# EAGLE design uass-antena-side (EAGLE 9.6.2)
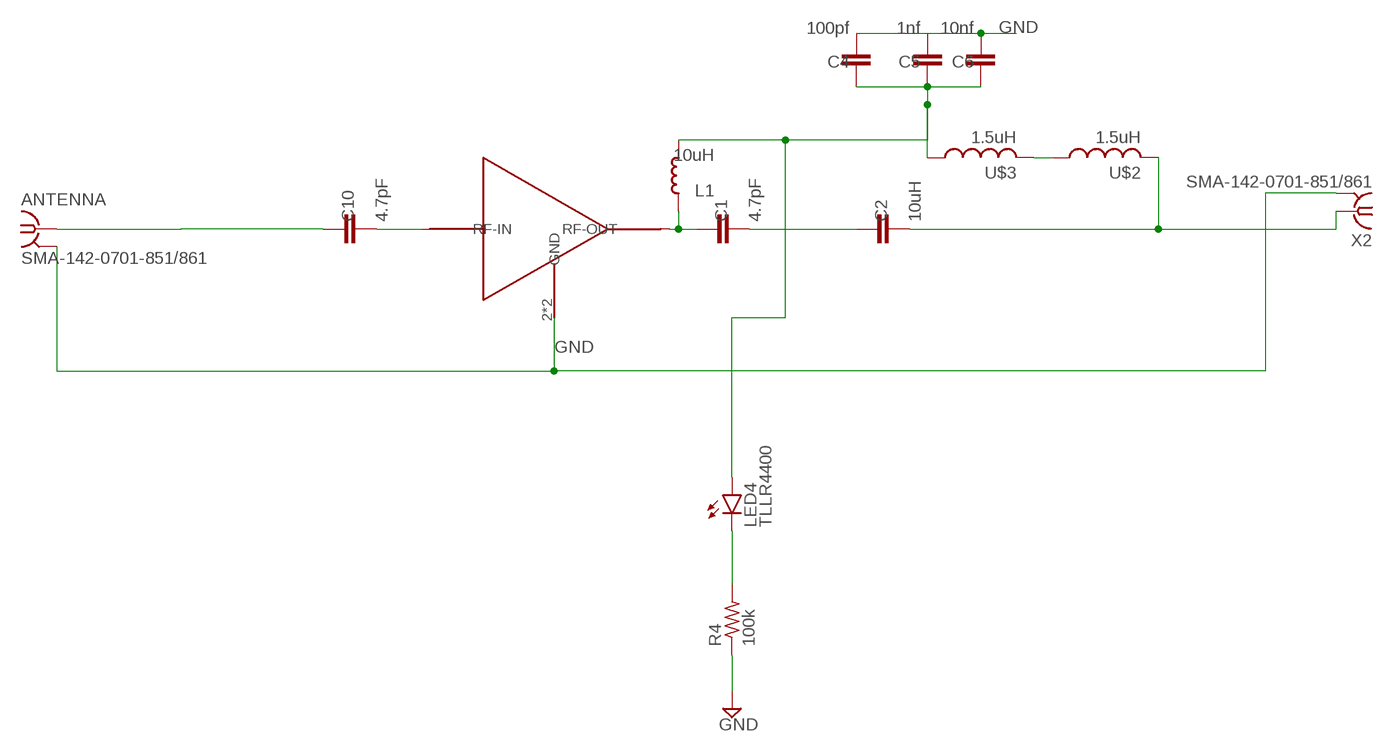
[diagram p0: schematic, sheet 1]

## Parts
ANTENNA  SMA-142-0701-851/861  [J502-ND-142-0701-851/861]
C1  4.7pF  10UF-0603-6.3V-20%  [0603]
C2  10uH  10UF-0603-6.3V-20%  [0603]
C4  100pf  10UF-0603-6.3V-20%  [0603]
C5  1nf  10UF-0603-6.3V-20%  [0603]
C6  10nf  10UF-0603-6.3V-20%  [0603]
C10  4.7pF  10UF-0603-6.3V-20%  [0603]
L1  10uH  L_0603  [L0603]
LED4  TLLR4400  [LED3MM]
R4  100k  R-US_R0603  [R0603]
U$1  PSA4-5043+  [PSA4-5043+]
U$2  1.5uH  L504  [C0504]
U$3  1.5uH  L504  [C0504]
X2  SMA-142-0701-851/861  [J502-ND-142-0701-851/861]

## Nets
5V: C4.1 C5.1 C6.1 L1.1 LED4.A U$3.1
GND: ANTENNA.G@1 ANTENNA.G@2 ANTENNA.G@3 ANTENNA.G@4 C4.2 C5.2 C6.2 R4.1 U$1.2(GND) U$1.4(GND) X2.G@1 X2.G@2 X2.G@3 X2.G@4
N$1: C2.2 U$2.2 X2.1
N$2: U$2.1 U$3.2
N$26: C1.2 C2.1
N$30: LED4.K(C) R4.2
N$32: ANTENNA.1 C10.1
N$33: C10.2 U$1.3(RF-IN)
N$34: C1.1 L1.2 U$1.1(RF-OUT)

## Library data of the parts
ANTENNA X2 = con-coax:SMA-: SMA 50 Ohm End Launch Jack Receptacle - Round Contact Johnson Components Source: www.johnsoncomponents.com .. J502-ND.pdf; MF: JOHNSON COMPONENTS; MPN: 142-0701-851; OC_FARNELL: 1019325; OC_NEWARK: 99F6798
C1 C2 C4-C6 C10 = SparkFun-Capacitors:10UF: 10.0µF ceramic capacitors A capacitor is a passive two-terminal electrical component used to store electrical energy temporarily in an electric field.; PROD_ID: CAP-11015; VALUE: 10uF
L1 = rc-master-smd:L_: INDUCTOR
LED4 = led:TLLR4400: Low Current (2mA) LED 3 mm Tinted Diffused Package color RED Source: Data sheet <http://www.farnell.com/datasheets/391100.pdf>; MF: VISHAY SEMICONDUCTOR; OC_FARNELL: 1612437
R4 = adafruit:R-US_: RESISTOR, American symbol
U$1 = PSA4-5043_:PSA4-5043+; AVAILABILITY: Unavailable; DESCRIPTION: Ultra Low Noise MMIC Amplifier, 50ohm, 0.05 to 4 GHz; MF: Mini-Circuits; MP: PSA4-5043+; PACKAGE: None; PRICE: None
U$2 U$3 = rcl-2:L504

## Board
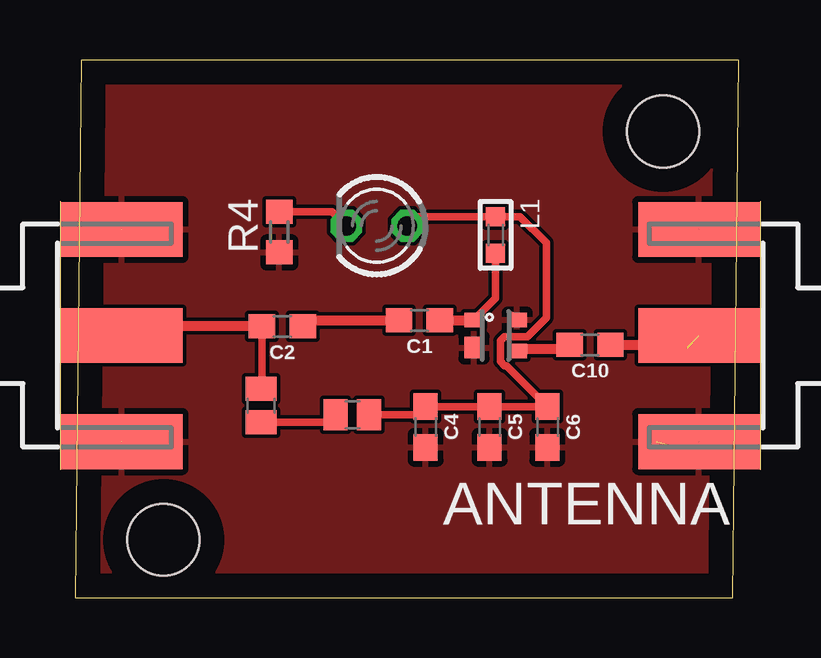
[diagram p1: board, top side]
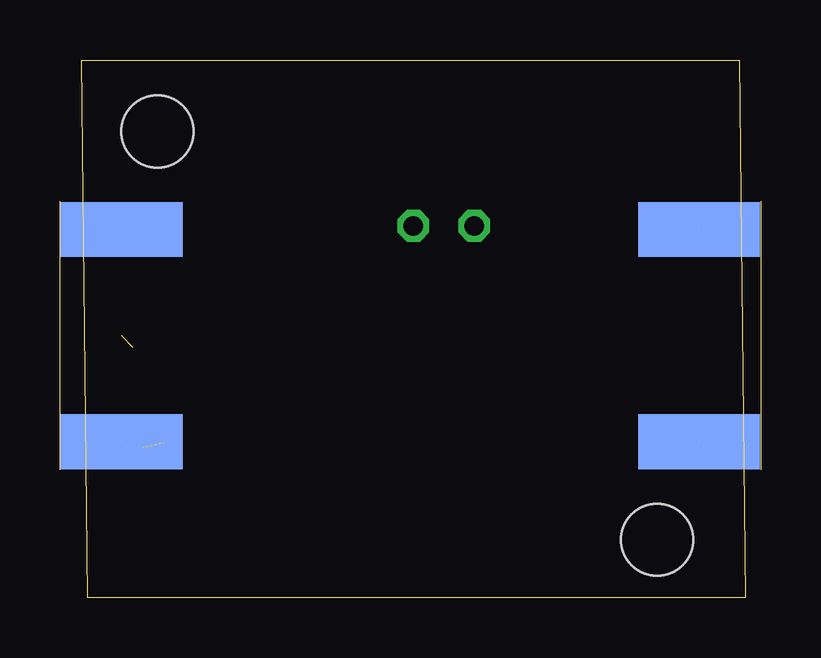
[diagram p2: board, bottom side, seen from below]

Size 27.67 x 22.4 mm. Coordinates in mm from the lower left corner, seen from the top.
Outline: 0,0 27.41,0 27.67,22.4 0.25,22.4 0,0
Copper layers (1*16): Top 0.035mm / dielectric 1.5mm / Bottom 0.035mm
Design rules "default": minimum track width 6mil, minimum drill 0.35mm, track to track 6mil, track to pad 6mil, pad to pad 6mil, via to via 6mil, smd to smd 6mil, copper to edge 40mil, drill to drill 6mil, minimum pad ring 10mil, minimum via ring 8mil, stop-mask expansion 4mil, vias tented up to drill 0mil, thermal gap 10mil
Holes 3 mm at 24.51,19.43 3.68,2.41

### Footprints (pad centres in the part's own frame; a part is rotated, then mirrored left to right if it is on the bottom)
J502-ND-142-0701-851/861 = smd 5.08 x 2.286: 1 2.565,0; G@1 2.565,4.42; G@2 2.565,-4.42 | smd 5.08 x 2.286 bottom: G@3 2.565,4.42; G@4 2.565,-4.42
0603 = smd 1.1 x 1: 1 -0.85,0; 2 0.85,0
L0603 = smd 0.8 x 0.8: 1 -0.762,0; 2 0.762,0
LED3MM = drill 0.813 octagon: A -1.27,0; K 1.27,0
R0603 = smd 1 x 1.1: 1 -0.85,0; 2 0.85,0
PSA4-5043+ = smd 0.6 x 0.8: 1 -0.65,-0.9; 3 0.65,0.9; 4 -0.65,0.9 | smd 0.9 x 0.8: 2 0.5,-0.9
C0504 = smd 1 x 1.3: 1 -0.7,0; 2 0.7,0

### Placement (x,y rotation side)
ANTENNA  28.58,10.92 180 top
C1  14.35,11.56 180 top
C2  8.64,11.3 180 top
C4  14.6,7.11 270 top
C5  17.27,7.11 270 top
C6  19.69,7.11 270 top
C10  21.46,10.54 180 top
L1  17.53,15.11 270 top
LED4  12.57,15.49 180 top
R4  8.51,15.24 90 top
U$1  17.53,10.92 270 top
U$2  7.75,8 90 top
U$3  11.56,7.62 180 top
X2  -0.64,10.92 0 top

### Tracks (layer width: path | path; a pad name or v marks a point on that pad's centre or on a via)
5V
  Top 0.305: LED4.A 14.22,15.88 L1.1 18.54,15.88 19.64,14.78 19.64,11.65 18.86,10.88 17.9,10.88 17.72,10.7 17.72,9.85 17.9,9.67 17.98,9.67 C6.1 C5.1 C4.1 14.26,7.62 U$3.1
GND  (5 unrouted)
  Top 0.254: U$1.4 18.21,11.79
  Top 0.305: U$1.2 16.55,10.5 | 24.04,6.26 24.26,6.48
  Top 0.406: 25.11,6.26 25.15,6.22
  pour Top: -1.65,24.51 29.59,24.51 29.59,-1.78 -1.65,-1.78
N$1
  Top 0.305: 2.33,10.92 X2.1 2.31,11.3 | 7.79,11.05 C2.2 7.79,8.74 U$2.2
  Top 0.406: C2.2 2.31,11.3
N$2
  Top 0.305: U$2.1 10.54,7.3 U$3.2
N$26
  Top 0.406: C2.1 9.74,11.56 C1.2
N$30
  Top 0.305: R4.2 10.71,16.09 LED4.K
N$32  (1 unrouted)
  Top 0.305: 24.38,10.54 25.4,10.54 25.53,10.41
  Top 0.406: C10.1 24.38,10.54
N$33
  Top 0.305: 20.59,10.52 C10.2
  Top 0.406: U$1.3 18.52,10.37 20.44,10.37 20.59,10.52
N$34
  Top 0.305: 16.61,11.56 U$1.1 17.53,12.47 L1.2
  Top 0.406: C1.1 16.61,11.56